# EasyEDA Pro project v1.eprj

# Schematic Schematic1
Board Name: Board1; Create Date: 2025-01-02; Page Name: P1; Project Name: v1; Schematic Name: Schematic1; Update Date: 2025-01-05; Company: myry; Drawed: myry; Page Size: A3; Reviewed: myry; Version: V1.0
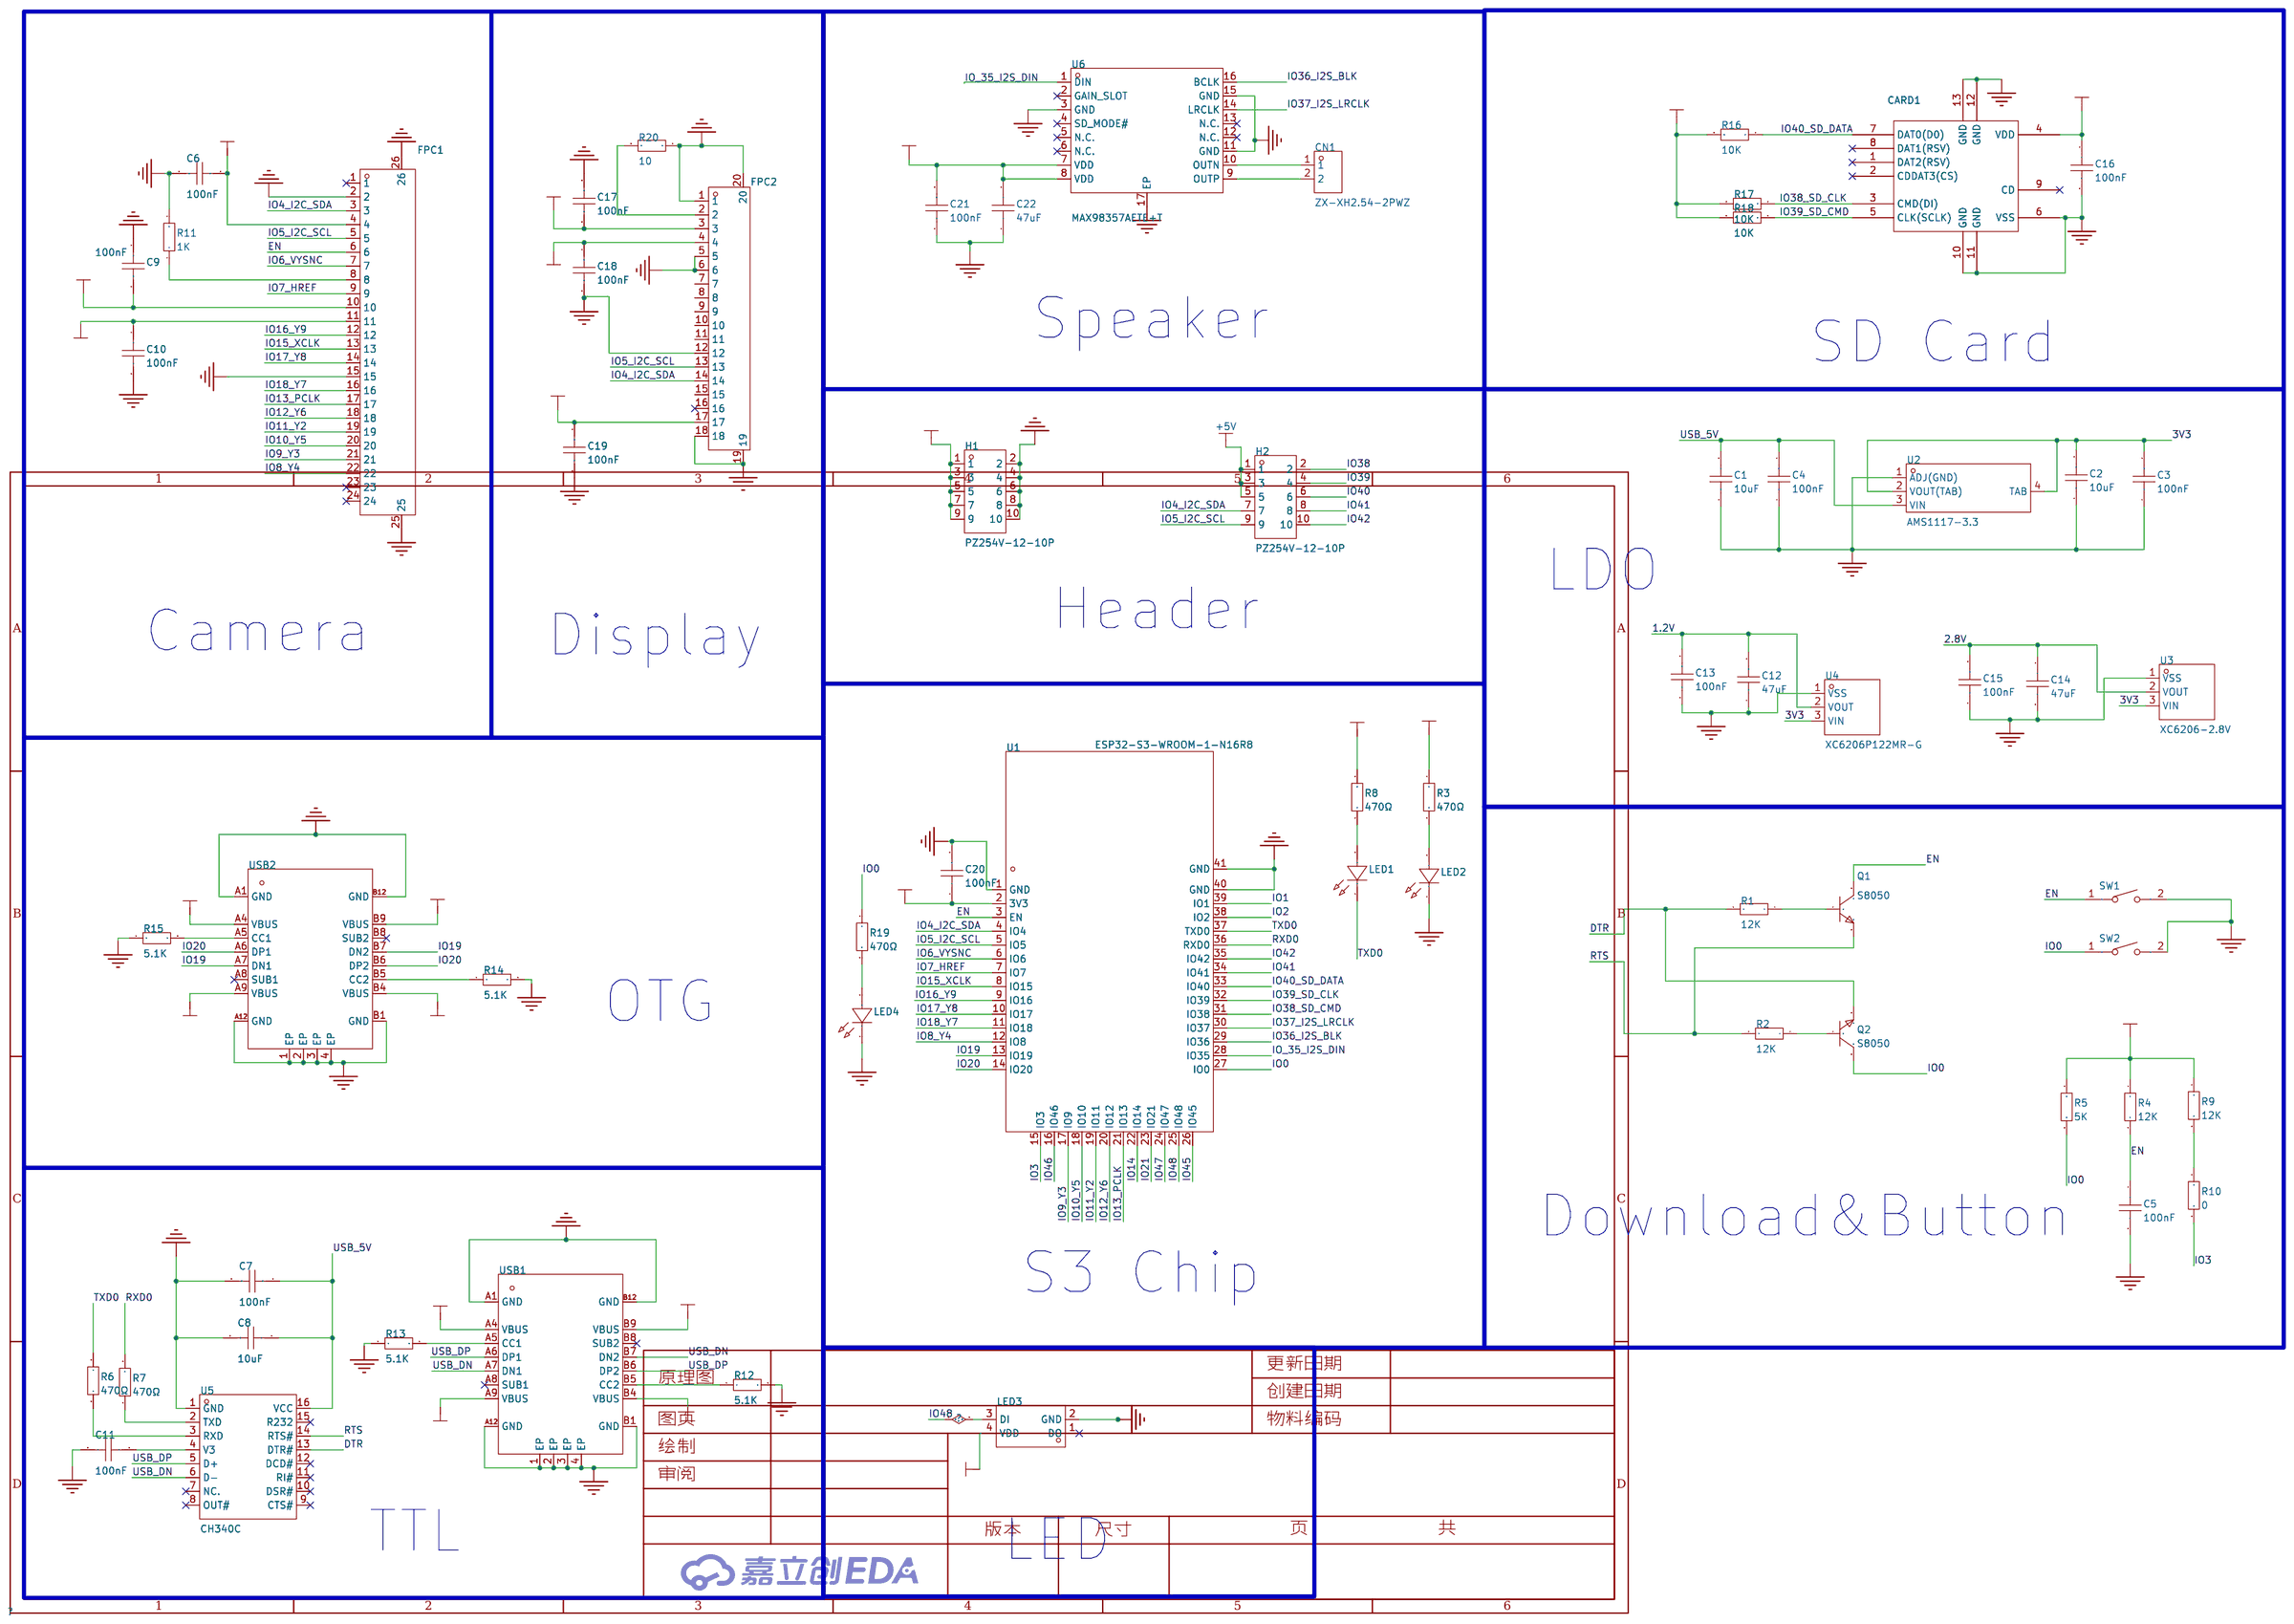
[diagram p0: schematic sheet]

## Parts
C1  10uF  [C0603]
C2  10uF  [C0603]
C3  100nF  [C0402]
C4  100nF  [C0402]
C5  100nF  [C0402]
C6  100nF  [C0402]
C7  100nF  [C0402]
C8  10uF  [C0603]
C9  100nF  [C0402]
C10  100nF  [C0402]
C11  100nF  [C0402]
C12  47uF  [C0603]
C13  100nF  [C0402]
C14  47uF  [C0603]
C15  100nF  [C0402]
C16  100nF  [C0402]
C17  100nF  [C0402]
C18  100nF  [C0402]
C19  100nF  [C0402]
C20  100nF  [C0402]
C21  100nF  [C0402]
C22  47uF  [C0603]
CARD1  TF-01A  [TF-SMD_TF-01A]
CN1  ZX-XH2.54-2PWZ  [CONN-TH_2P-P2.50_ZX-XH2.54-2PWZ]
FPC1  0.5K-DX-24PWBG  [FPC-SMD_HDGC_0.5K-DX-24PWBG]
FPC2  FPC-05F-18PH20  [FPC-SMD_18P-P0.50_FPC-05F-18PH20]
H1  PZ254V-12-10P  [HDR-TH_10P-P2.54-V-M-R2-C5-S2.54]
H2  PZ254V-12-10P  [HDR-TH_10P-P2.54-V-M-R2-C5-S2.54]
LED1  XL-1608SURC-06  [LED0603-RD_RED]
LED2  XL-1608SURC-06  [LED0603-RD_RED]
LED3  XL-2020RGBC-WS2812B  [LED-SMD_4P-L2.0-W2.0-BR-1]
LED4  XL-1608SURC-06  [LED0603-RD_RED]
Q1  S8050  [SOT-23-3_L2.9-W1.3-P1.90-LS2.3-BR]
Q2  S8050  [SOT-23-3_L2.9-W1.3-P1.90-LS2.3-BR]
R1  12K  [R0402]
R2  12K  [R0402]
R3  470Ω  [R0402]
R4  12K  [R0402]
R5  5K  [R0402]
R6  470Ω  [R0402]
R7  470Ω  [R0402]
R8  470Ω  [R0402]
R9  12K  [R0402]
R10  0  [R0402]
R11  1K  [R0402]
R12  5.1K  [R0402]
R13  5.1K  [R0402]
R14  5.1K  [R0402]
R15  5.1K  [R0402]
R16  10K  [R0402]
R17  10K  [R0402]
R18  10K  [R0402]
R19  470Ω  [R0402]
R20  10  [R0402]
SW1  TS-1088-AR02016  [SW-SMD_L3.9-W3.0-P4.45]
SW2  TS-1088-AR02016  [SW-SMD_L3.9-W3.0-P4.45]
U1  ESP32-S3-WROOM-1-N16R8  [WIRELM-SMD_ESP32-S3-WROOM-1]
U2  AMS1117-3.3  [SOT-223-4_L6.5-W3.5-P2.30-LS7.0-BR]
U3  XC6206-2.8V  [SOT-23-3_L2.9-W1.6-P1.90-LS2.8-BR]
U4  XC6206P122MR-G  [SOT-23-3_L2.9-W1.6-P1.90-LS2.8-BR]
U5  CH340C  [SOP-16_L10.0-W3.9-P1.27-LS6.0-BL]
U6  MAX98357AETE+T  [TQFN-16_L3.0-W3.0-P0.50-BL-EP1.5]
USB1  KH-TYPE-C-16P  [USB-C-SMD_KH-TYPE-C-16P]
USB2  KH-TYPE-C-16P  [USB-C-SMD_KH-TYPE-C-16P]

## Library data of the parts
C1 C2 C8 = CGA0603X5R106K100JT: LCSC Part Name: 10uF ±10% 10V; Supplier Part: C6119842; Manufacturer: HRE(芯声); Supplier Footprint: 0603; JLCPCB Part Class: 扩展库; Supplier: LCSC; Tolerance: ±10%; Voltage Rated: 10V; Temperature Coefficient: X5R
C3-C7 C9-C11 C13 C15-C21 = CL05B104KO5NNNC: LCSC Part Name: 100nF ±10% 16V; Supplier Part: C1525; Manufacturer: SAMSUNG(三星); Supplier Footprint: 0402; Datasheet: https://atta.szlcsc.com/upload/public/pdf/source/20160218/1457707763339.pdf; Supplier: LCSC; Tolerance: ±10%; Voltage Rated: 16V; Temperature Coefficient: X7R
C12 C14 C22 = CL10A476MQ8QRNC: LCSC Part Name: 47uF ±20% 6.3V; Supplier Part: C730416; Manufacturer: SAMSUNG(三星); Supplier Footprint: 0603; JLCPCB Part Class: 扩展库; Datasheet: https://atta.szlcsc.com/upload/public/pdf/source/20160218/1457707763339.pdf; Supplier: LCSC; Tolerance: ±20%; Voltage Rated: 6.3V; Temperature Coefficient: X5R
CARD1 = TF-01A_C91145: LCSC Part Name: 自弹式 MicroSD卡(TF卡) 卡座; Supplier Part: C91145; Manufacturer: 韩国韩荣; Supplier Footprint: SMD; JLCPCB Part Class: 扩展库; Datasheet: https://atta.szlcsc.com/upload/public/pdf/source/20190322/C91145_63CBD6FB4639A3A3EC6A9721F18AE0FB.pdf; Supplier: LCSC; Card Connection Mode: 自弹式; Card Type: MicroSD卡(TF卡); Connector Type: 卡座; Supplementary Features: 带定位柱; Maximum Body Height: 1.85mm
CN1 = ZX-XH2.54-2PWZ: Supplier Part: C7429641; Manufacturer: Megastar(兆星); Supplier Footprint: 弯插,P=2.54mm; JLCPCB Part Class: 扩展库; Datasheet: https://atta.szlcsc.com/upload/public/pdf/source/20230619/56AE8F2E01CDFEAA97FC89B5ED558AB5.pdf; Supplier: LCSC; Pins Structure: 1x2P; Pitch: 2.54mm; Mounting Style: 弯插; Reference Series: XH; Number of Pins: 2P; Number of Rows: 1; Number of PINs Per Row: 2; Current Rating (Max): 3A; Contact Material: 黄铜; Contact Plating: 锡; Operating Temperature Range: -25℃~+85℃
FPC1 = 0.5K-DX-24PWBG: LCSC Part Name: 间距:0.5mm P数:24P 翻盖式 下接; Supplier Part: C2911895; Manufacturer: HDGC(华德共创); Supplier Footprint: SMD,P=0.5mm,卧贴; JLCPCB Part Class: 扩展库; Datasheet: https://atta.szlcsc.com/upload/public/pdf/source/20211029/EDC59C5BA257836333CAE013AFC084A6.pdf; Supplier: LCSC; Locking Feature: 翻盖式; Contact Type: 下接; Number of Contacts: 24P; Pitch: 0.5mm; Mounting Type: 卧贴; FFC, FCB Thickness: 0.3mm; Height Above Board: 2mm; Operating Temperature Range: -20℃~+85℃
FPC2 = FPC-05F-18PH20: LCSC Part Name: 间距:0.5mm P数:18P 翻盖式 下接; Supplier Part: C2856802; Manufacturer: XUNPU(讯普); Supplier Footprint: SMD,P=0.5mm,卧贴; Datasheet: https://atta.szlcsc.com/upload/public/pdf/source/20210922/C2856802_2A845D1961F33AEC1ED22CECB292335F.pdf; Supplier: LCSC; Locking Feature: 翻盖式; Contact Type: 下接; Number of Contacts: 18P; Pitch: 0.5mm; Mounting Type: 卧贴; FFC, FCB Thickness: 0.3mm; Height Above Board: 2mm; Operating Temperature Range: -25℃~+85℃
H1 H2 = PZ254V-12-10P: LCSC Part Name: 间距:2.54mm 2x5P 直插 方针; Supplier Part: C492422; Manufacturer: XFCN(兴飞); Supplier Footprint: 插件,P=2.54mm; Datasheet: https://atta.szlcsc.com/upload/public/pdf/source/20200309/C492422_5020CEA01BE7051F9EA9DD81AB0A25E3.pdf; Supplier: LCSC; Pin Structure: 2x5P; Pitch: 2.54mm; Row Spacing: 2.54mm; Circluar Pins/Square Pins: 方针; Mounting Type: 直插; Number of Rows: 双排; Number of Pins: 10P; Length of Mating Pin: 6mm; Insulation Height: 2.5mm; Length of End Connection Pin: 3mm; Contact Material: 黄铜; Operating Temperature Range: -40℃~+105℃; Color: 黑色
LED1 LED2 LED4 = XL-1608SURC-06: Supplier Part: C965799; Manufacturer: XINGLIGHT(成兴光); Supplier Footprint: 0603; JLCPCB Part Class: 扩展库; Datasheet: https://atta.szlcsc.com/upload/public/pdf/source/20221102/D860AFDD1CDB02C5A8064103A32707E2.pdf; Supplier: LCSC; Emitted Color: 红色; Power Dissipation: 55mW; Forward Current: 25mA; Dominant Wavelength: 617nm~621nm; Peak Wavelength: 623nm; Lens Color: 无色透明透镜; Viewing Angle: 120°; Mounting Sytle: 正贴; Operating Temperature: -30℃~+85℃
LED3 = XL-2020RGBC-WS2812B: LCSC Part Name: 幻彩透明; Supplier Part: C5349955; Manufacturer: XINGLIGHT(成兴光); Supplier Footprint: 2020; JLCPCB Part Class: 扩展库; Datasheet: https://atta.szlcsc.com/upload/public/pdf/source/20230111/97A2D5930F183799801175706AF118AF.pdf; Supplier: LCSC; Wavelength: 620nm~625nm；470nm~475nm；525nm~530nm; Luminous Intensity: 150mcd；150mcd；400mcd; Lens Color: 半透明雾状透镜; Installation method: 正贴; Operating Temperature: -20℃~+85℃
Q1 Q2 = S8050_C20069125: LCSC Part Name: hFE:200-350，丝印:J3Y; Supplier Part: C20069125; Manufacturer: 宏迦橙; Supplier Footprint: SOT-23; JLCPCB Part Class: 扩展库; Datasheet: https://atta.szlcsc.com/upload/public/pdf/source/20240403/2D78449C96B6E27F13BF8BDF79E27159.pdf; Supplier: LCSC; Transistor Type: NPN; Collector Current (Ic): 500mA; Collector-Emitter Breakdown Voltage (Vceo): 25V; Power Dissipation (Pd): 300mW; DC Current Gain (hFE@Ic,Vce): 120@50mA,1.0V; Transition Frequency (fT): 100MHz; Collector Cut-Off Current (Icbo): 100nA; Collector-Emitter Saturation Voltage (VCE(sat)@Ic,Ib): 600mV@500mA,50mA; Operating Temperature: -55℃~+150℃
R1-R20 = 0402WGF4700TCE: LCSC Part Name: 470Ω ±1% 62.5mW 厚膜电阻; Supplier Part: C25117; Manufacturer: UNI-ROYAL(厚声); Supplier Footprint: 0402; JLCPCB Part Class: 基础库; Datasheet: https://atta.szlcsc.com/upload/public/pdf/source/20200306/C422600_1E6D84923E4A46A82E41ADD87F860B5C.pdf; Supplier: LCSC; Type: 厚膜电阻; Tolerance: ±1%; Power(Watts): 62.5mW; Overload Voltage (Max): 50V; Temperature Coefficient: ±100ppm/℃; Operating Temperature Range: -55℃~+155℃
SW1 SW2 = TS-1088-AR02016: LCSC Part Name: 4*3*2mm 立贴 轻触开关; Supplier Part: C720477; Manufacturer: XUNPU(讯普); Supplier Footprint: SMD; JLCPCB Part Class: 扩展库; Datasheet: https://atta.szlcsc.com/upload/public/pdf/source/20200810/C720475_60D09DD6C54279ADDB2DC25100F1CC11.pdf; Supplier: LCSC; Circuit: 单刀单掷; Actuator Style: 圆形按钮; Operating Force: 160gf; Mounting Style: 立贴; Switch Length: 4mm; Switch Width: 3mm; Switch Height: 2mm; Strike Gundam: 不带; Contact Current: 50mA; Voltage Rating (DC): 12V; Insulation Resistance: 100MΩ; Actuator/Cap Color: 黑色; Pin Style: SMD接片; Mechanical Life: 10万次; Operating Temperature: -30℃~+80℃
U1 = ESP32-S3-WROOM-1-N16R8: LCSC Part Name: 通用型Wi-Fi+低功耗蓝牙MCU模组; Supplier Part: C2913202; Manufacturer: ESPRESSIF(乐鑫); Supplier Footprint: SMD,18x25.5mm; JLCPCB Part Class: 扩展库; Datasheet: https://atta.szlcsc.com/upload/public/pdf/source/20220705/4E799F39581577F766659887F738A439.pdf; Supplier: LCSC
U2 = AMS1117-3.3_C347222: LCSC Part Name: 输出:3.3V 电流:1A 耐压:12V; Supplier Part: C347222; Manufacturer: UMW(友台半导体); Supplier Footprint: SOT-223; JLCPCB Part Class: 扩展库; Datasheet: https://atta.szlcsc.com/upload/public/pdf/source/20241218/BAF0263FA2E44BCD8AF41AA4FA04EFAA.pdf; Supplier: LCSC; Output Type: 固定; Maximum Input Voltage: 12V; Output Voltage: 3.3V; Output Current: 1A; Power Supply Rejection Ratio (PSRR): 60dB@(120Hz); Dropout Voltage: 1.3V@(1A); Feature: 过流保护(OCP); Output Polarity: 正极; Number of Outputs: 1
U3 = XC6206-2.8V: LCSC Part Name: 输入6V 输出2.8V 250mA; Supplier Part: C2892669; Manufacturer: YONGYUTAI(永裕泰); Supplier Footprint: SOT-23-3L; JLCPCB Part Class: 扩展库; Datasheet: https://atta.szlcsc.com/upload/public/pdf/source/20210901/DE3C77F0CE73FFE8F7C655BE9B94CB06.pdf; Supplier: LCSC; Output Type: 固定; Maximum Input Voltage: 6V; Output Voltage: 2.8V; MAX Output Current: 250mA; Operating Temperature: -40℃~+85℃@(Tj); Output Polarity: 正极; Number of Outputs: 1
U4 = XC6206P122MR-G: LCSC Part Name: 输入7V 输出1.2V~1.2V 60mA; Supplier Part: C424699; Manufacturer: TOREX(特瑞仕); Supplier Footprint: SOT-23; JLCPCB Part Class: 扩展库; Datasheet: https://atta.szlcsc.com/upload/public/pdf/source/20200117/C484266_EE638359EA530088949E891FD0EEEA32.pdf; Supplier: LCSC; Output Type: 固定; Maximum Input Voltage: 7V; Output Voltage: 1.2V; MAX Output Current: 60mA; Dropout Voltage: 960mV@(60mA); standby current: 3uA; Operating Temperature: -40℃~+85℃@(Ta); Output Polarity: 正极; Number of Outputs: 1
U5 = CH340C: LCSC Part Name: CH340C USB转串口芯片 CH340; Supplier Part: C84681; Manufacturer: WCH(南京沁恒); Supplier Footprint: SOP-16; Datasheet: https://atta.szlcsc.com/upload/public/pdf/source/20240619/63986D8440D4E5267A77ACD891CC4DE3.pdf; Supplier: LCSC; Applications Function: 收发器; Protocol: USB 2.0; Supply Voltage: 3.3V；5V; Data Rate: 2Mbps
U6 = MAX98357AETE+T: LCSC Part Name: 微型、低成本、PCM 类 D 级放大器具有 AB 级性能; Supplier Part: C910544; Manufacturer: ADI(亚德诺)/MAXIM(美信); Supplier Footprint: TQFN-16-EP(3x3); JLCPCB Part Class: 扩展库; Datasheet: https://atta.szlcsc.com/upload/public/pdf/source/20210106/C910544_CB6DE4B2CEE254A72E6BDB40E718D281.pdf; Supplier: LCSC; Speaker Channels: 单声道; Output Power: 3.2Wx2@4Ω; Supply Voltage: 2.5V~5.5V; Operating Temperature: -40℃~+85℃
USB1 USB2 = KH-TYPE-C-16P: LCSC Part Name: Type-C 母 卧贴; Supplier Part: C709357; Manufacturer: kinghelm(金航标); Supplier Footprint: SMD; Datasheet: https://atta.szlcsc.com/upload/public/pdf/source/20200911/C709357_AA8DCEB38BB20E3035A7ED7AE7667837.pdf; Supplier: LCSC; Connector Type: Type-C; Gender: 母; Number of Ports: 1; Number of Contacts: 16P; Mounting Style: 卧贴; Current Rating - Power (Max): 3A; Operating Temperature Range: -40℃~+85℃

## Nets
1.2V: C9.2 C12.2 C13.2 FPC1.10 U4.2(VOUT)
1.8V: C18.1 FPC2.4
2.8V: C6.1 C10.1 C14.1 C15.2 FPC1.4 FPC1.11 U3.2(VOUT)
3V3: C2.2 C3.2 C16.1 C17.2 C19.1 C20.1 C21.2 C22.2 CARD1.4(VDD) FPC2.3 FPC2.17 H1.1 H1.3 H1.5 H1.7 H1.9 R3.1 R4.1 R5.1 R8.2 R9.1 R16.2 R17.2 R18.2 U1.2(3V3) U2.2(VOUT(TAB)) U2.4(TAB) U3.3(VIN) U4.3(VIN) U6.7(VDD) U6.8(VDD)
+5V: H2.1 H2.3 H2.5
GND: C1.1 C2.1 C3.1 C4.1 C5.2 C6.2 C7.2 C8.2 C9.1 C10.2 C11.2 C12.1 C13.1 C14.2 C15.1 C16.2 C17.1 C18.2 C19.2 C20.2 C21.1 C22.1 CARD1.6(VSS) CARD1.10(GND) CARD1.11(GND) CARD1.12(GND) CARD1.13(GND) FPC1.2 FPC1.15 FPC1.25 FPC1.26 FPC2.1 FPC2.5 FPC2.6 FPC2.12 FPC2.18 FPC2.19 FPC2.20 H1.2 H1.4 H1.6 H1.8 H1.10 LED2.1(K) LED3.2(GND) LED4.1(K) R11.2 R12.2 R13.1 R14.2 R15.1 R20.1 SW1.2 SW2.2 U1.1(GND) U1.40(GND) U1.41(GND) U2.1(ADJ(GND)) U3.1(VSS) U4.1(VSS) U5.1(GND) U6.3(GND) U6.11(GND) U6.15(GND) U6.17(EP) USB1.1(EP) USB1.2(EP) USB1.3(EP) USB1.4(EP) USB1.A1(GND) USB1.A12(GND) USB1.B1(GND) USB1.B12(GND) USB2.1(EP) USB2.2(EP) USB2.3(EP) USB2.4(EP) USB2.A1(GND) USB2.A12(GND) USB2.B1(GND) USB2.B12(GND)
DTR: Q2.2(E) R1.2 U5.13(DTR#)
EN: C5.1 FPC1.6 Q1.3(C) R4.2 SW1.1 U1.3(EN)
IO0: Q2.3(C) R5.2 R19.1 SW2.1 U1.27(IO0)
IO1: U1.39(IO1)
IO2: U1.38(IO2)
IO3: R10.2 U1.15(IO3)
IO4_I2C_SDA: FPC1.3 FPC2.14 H2.7 U1.4(IO4)
IO5_I2C_SCL: FPC1.5 FPC2.13 H2.9 U1.5(IO5)
IO6_VYSNC: FPC1.7 U1.6(IO6)
IO7_HREF: FPC1.9 U1.7(IO7)
IO8_Y4: FPC1.22 U1.12(IO8)
IO9_Y3: FPC1.21 U1.17(IO9)
IO10_Y5: FPC1.20 U1.18(IO10)
IO11_Y2: FPC1.19 U1.19(IO11)
IO12_Y6: FPC1.18 U1.20(IO12)
IO13_PCLK: FPC1.17 U1.21(IO13)
IO14: U1.22(IO14)
IO15_XCLK: FPC1.13 U1.8(IO15)
IO16_Y9: FPC1.12 U1.9(IO16)
IO17_Y8: FPC1.14 U1.10(IO17)
IO18_Y7: FPC1.16 U1.11(IO18)
IO19: U1.13(IO19) USB2.A7(DN1) USB2.B7(DN2)
IO20: U1.14(IO20) USB2.A6(DP1) USB2.B6(DP2)
IO21: U1.23(IO21)
IO36_I2S_BLK: U1.29(IO36) U6.16(BCLK)
IO37_I2S_LRCLK: U1.30(IO37) U6.14(LRCLK)
IO38: H2.2
IO38_SD_CLK: CARD1.3(CMD(DI)) R17.1
IO38_SD_CMD: U1.31(IO38)
IO39: H2.4
IO39_SD_CLK: U1.32(IO39)
IO39_SD_CMD: CARD1.5(CLK(SCLK)) R18.1
IO40: H2.6
IO40_SD_DATA: CARD1.7(DAT0(D0)) R16.1 U1.33(IO40)
IO41: H2.8 U1.34(IO41)
IO42: H2.10 U1.35(IO42)
IO45: U1.26(IO45)
IO46: U1.16(IO46)
IO47: U1.24(IO47)
IO48: LED3.3(DI) U1.25(IO48)
IO_35_I2S_DIN: U1.28(IO35) U6.1(DIN)
RTS: Q1.2(E) R2.2 U5.14(RTS#)
RXD0: R7.2 U1.36(RXD0)
TXD0: LED1.1(K) R6.2 U1.37(TXD0)
USB_5V: C1.2 C4.2 C7.1 C8.1 LED3.4(VDD) U2.3(VIN) U5.16(VCC) USB1.A4(VBUS) USB1.A9(VBUS) USB1.B4(VBUS) USB1.B9(VBUS) USB2.A4(VBUS) USB2.A9(VBUS) USB2.B4(VBUS) USB2.B9(VBUS)
USB_DN: U5.6(D-) USB1.A7(DN1) USB1.B7(DN2)
USB_DP: U5.5(D+) USB1.A6(DP1) USB1.B6(DP2)
$1N2354: R7.1 U5.2(TXD)
$1N2360: R6.1 U5.3(RXD)
$1N2405: C11.1 U5.4(V3)
$1N2645: Q1.1(B) R1.1
$1N2696: Q2.1(B) R2.1
$1N2996: R9.2 R10.1
$1N4989: FPC1.8 R11.1
$1N10095: FPC2.2 R20.2
$1N11048: CN1.1 U6.10(OUTN)
$1N11058: CN1.2 U6.9(OUTP)
Net-(LED1-2): LED1.2(A) R8.1
Net-(LED2-2): LED2.2(A) R3.2
Net-(LED4-2): LED4.2(A) R19.2
Net-(R12-1): R12.1 USB1.B5(CC2)
Net-(R13-2): R13.2 USB1.A5(CC1)
Net-(R14-1): R14.1 USB2.B5(CC2)
Net-(R15-2): R15.2 USB2.A5(CC1)

Not connected (* = marked no-connect by the designer): CARD1 1(DAT2(RSV))* 2(CDDAT3(CS))* 8(DAT1(RSV))* 9(CD)*; FPC1 1* 23* 24*; FPC2 7 8 9 10 11 15 16*; LED3 1(DO)*; U5 7(NC.)* 8(OUT#)* 9(CTS#)* 10(DSR#)* 11(RI#)* 12(DCD#)* 15(R232)*; U6 2(GAIN_SLOT)* 4(SD_MODE#)* 5(N.C.)* 6(N.C.)* 12(N.C.)* 13(N.C.)*; USB1 A8(SUB1)* B8(SUB2)*; USB2 A8(SUB1)* B8(SUB2)*

## Notes on the sheet
- Speaker
- SD Card
- LDO
- Header
- Camera
- Display
- OTG
- Download&Button
- S3 Chip
- TTL
- LED

# Board PCB1
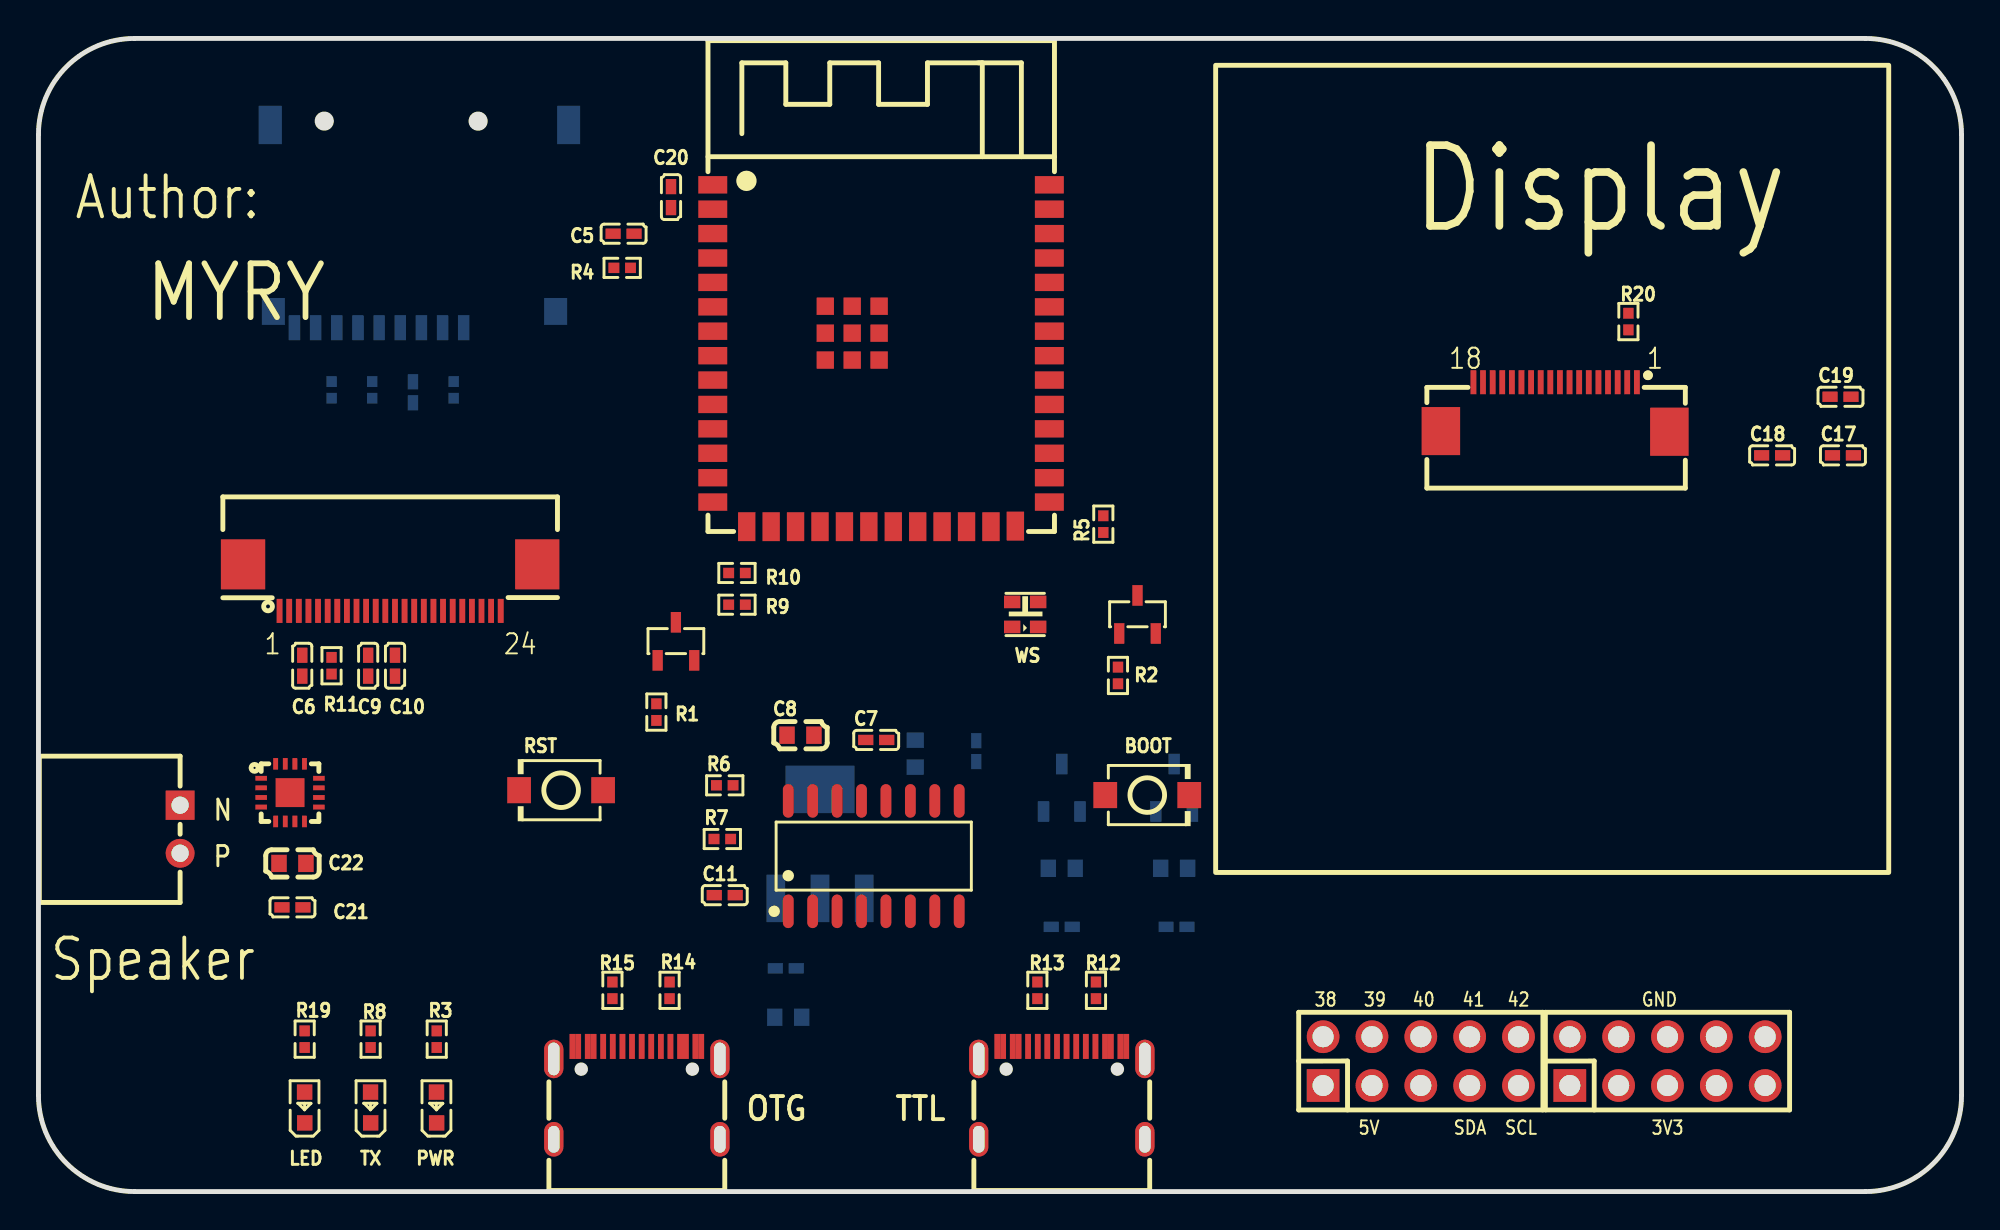
[diagram p1: board, top side]
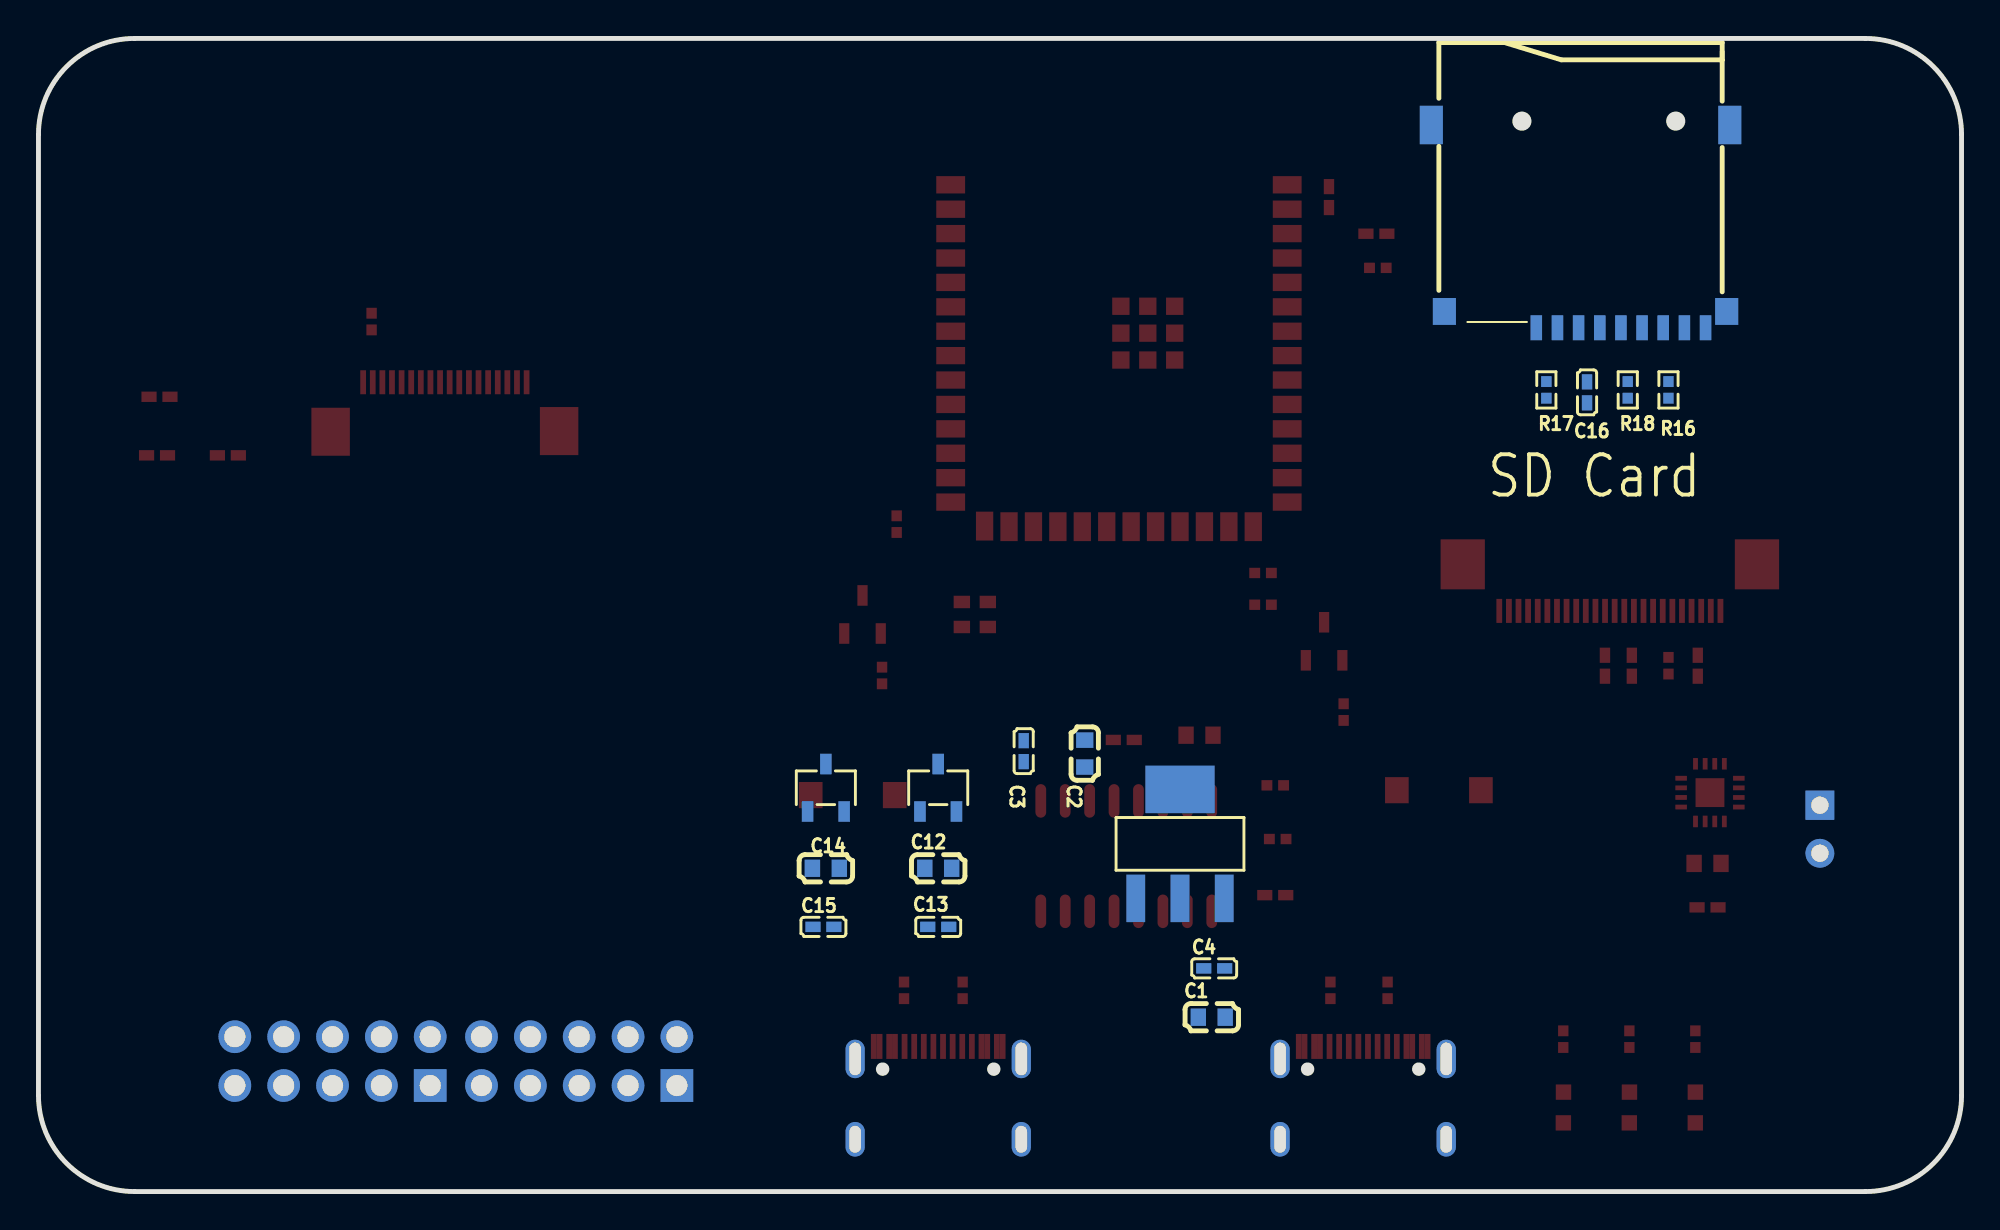
[diagram p2: board, bottom side, seen from below]

Outline 100 x 60 mm; copper layers: Top Layer, Bottom Layer. Coordinates in mm from the lower left corner of the outline.
Outline path: 0,55 0,5 arc(1.46,1.46) 5,0 95,0 arc(98.54,1.46) 100,5 100,55 arc(98.54,58.54) 95,60 5,60 arc(1.46,58.54) 0,55
Stack: Top Layer 0.035mm / Dielectric1 1.51mm FR4 er 4.5 / Bottom Layer 0.035mm

## Design rules (mm)
template: JLCPCB Capability(Two Layers Board)
spacing copperThickness1oz (default): track to track 0.102, other pairs 0.152 to 0.3
spacing copperThickness2oz: track to track 0.203, other pairs 0.152 to 0.3
track width copperThickness1oz (default): min 0.127, default 0.254, max 2.54
track width copperThickness2oz: min 0.203, default 0.254, max 2.54
differential pair differentialPair (default): width min 0.127, default 0.254, max 2.54; gap min 0.152, default 0.152
via viaSize (default): diameter min 0.5, default 0.61, max 10; hole min 0.3, default 0.305, max 6.3

## Placement (name value [footprint] x y rotation side)
BOOT  TS-1088-AR02016  [SW-SMD_L3.9-W3.0-P4.45]  57.66 20.63 0 top
C1  10uF  [C0603]  38.99 9.07 180 bottom
C2  10uF  [C0603]  45.59 22.79 90 bottom
C3  100nF  [C0402]  48.77 22.92 90 bottom
C4  100nF  [C0402]  38.86 11.61 180 bottom
C5  100nF  [C0402]  30.43 49.84 180 top
C6  100nF  [C0402]  13.72 27.36 270 top
C7  100nF  [C0402]  43.56 23.5 0 top
C8  10uF  [C0603]  39.62 23.75 0 top
C9  100nF  [C0402]  17.14 27.36 90 top
C10  100nF  [C0402]  18.54 27.36 270 top
C11  100nF  [C0402]  35.69 15.42 0 top
C12  47uF  [C0603]  53.21 16.82 180 bottom
C13  100nF  [C0402]  53.21 13.77 180 bottom
C14  47uF  [C0603]  59.06 16.82 0 bottom
C15  100nF  [C0402]  59.18 13.77 180 bottom
C16  100nF  [C0402]  19.47 41.58 270 bottom
C17  100nF  [C0402]  93.83 38.31 0 top
C18  100nF  [C0402]  90.15 38.31 0 top
C19  100nF  [C0402]  93.71 41.36 0 top
C20  100nF  [C0402]  32.89 51.75 90 top
C21  100nF  [C0402]  13.21 14.79 0 top
C22  47uF  [C0603]  13.21 17.07 0 top
CARD1  TF-01A  [TF-SMD_TF-01A]  19.81 50.22 0 bottom
CN1  ZX-XH2.54-2PWZ  [CONN-TH_2P-P2.50_ZX-XH2.54-2PWZ]  7.37 18.85 270 top
FPC1  0.5K-DX-24PWBG  [FPC-SMD_HDGC_0.5K-DX-24PWBG]  18.29 31.42 180 top
FPC2  FPC-05F-18PH20  [FPC-SMD_18P-P0.50_FPC-05F-18PH20]  78.87 40.82 0 top
H1  PZ254V-12-10P  [HDR-TH_10P-P2.54-V-M-R2-C5-S2.54]  84.71 6.79 0 top
H2  PZ254V-12-10P  [HDR-TH_10P-P2.54-V-M-R2-C5-S2.54]  71.88 6.79 0 top
LED  XL-1608SURC-06  [LED0603-RD_RED]  13.84 4.37 90 top
OTG  KH-TYPE-C-16P  [USB-C-SMD_KH-TYPE-C-16P]  31.12 5.14 0 top
PWR  XL-1608SURC-06  [LED0603-RD_RED]  20.7 4.37 90 top
Q1  S8050  [SOT-23-3_L2.9-W1.3-P1.90-LS2.3-BR]  33.15 28.63 270 top
Q2  S8050  [SOT-23-3_L2.9-W1.3-P1.90-LS2.3-BR]  57.15 30.03 270 top
R1  12K  [R0402]  32.13 24.95 270 top
R2  12K  [R0402]  56.13 26.85 270 top
R3  470Ω  [R0402]  20.71 7.93 270 top
R4  12K  [R0402]  30.35 48.06 0 top
R5  5K  [R0402]  55.37 34.73 90 top
R6  470Ω  [R0402]  35.69 21.14 0 top
R7  470Ω  [R0402]  35.56 18.34 0 top
R8  470Ω  [R0402]  17.27 7.93 90 top
R9  12K  [R0402]  36.32 30.54 180 top
R10  0  [R0402]  36.32 32.19 0 top
R11  1K  [R0402]  15.24 27.36 270 top
R12  5.1K  [R0402]  54.99 10.47 90 top
R13  5.1K  [R0402]  51.94 10.47 270 top
R14  5.1K  [R0402]  32.82 10.47 90 top
R15  5.1K  [R0402]  29.84 10.47 270 top
R16  10K  [R0402]  15.24 41.71 270 bottom
R17  10K  [R0402]  21.59 41.71 270 bottom
R18  10K  [R0402]  17.36 41.71 270 bottom
R19  470Ω  [R0402]  13.84 7.93 270 top
R20  10  [R0402]  82.68 45.27 270 top
RST  TS-1088-AR02016  [SW-SMD_L3.9-W3.0-P4.45]  27.18 20.88 180 top
TTL  KH-TYPE-C-16P  [USB-C-SMD_KH-TYPE-C-16P]  53.21 5.14 0 top
TX  XL-1608SURC-06  [LED0603-RD_RED]  17.27 4.37 90 top
U1  ESP32-S3-WROOM-1-N16R8  [WIRELM-SMD_ESP32-S3-WROOM-1]  43.81 43.49 0 top
U2  AMS1117-3.3  [SOT-223-4_L6.5-W3.5-P2.30-LS7.0-BR]  40.64 18.09 270 bottom
U3  XC6206-2.8V  [SOT-23-3_L2.9-W1.6-P1.90-LS2.8-BR]  59.06 21.01 270 bottom
U4  XC6206P122MR-G  [SOT-23-3_L2.9-W1.6-P1.90-LS2.8-BR]  53.21 21.01 270 bottom
U5  CH340C  [SOP-16_L10.0-W3.9-P1.27-LS6.0-BL]  43.43 17.45 0 top
U6  MAX98357AETE+T  [TQFN-16_L3.0-W3.0-P0.50-BL-EP1.5]  13.08 20.76 270 top
WS  XL-2020RGBC-WS2812B  [LED-SMD_4P-L2.0-W2.0-BR-1]  51.31 30.03 0 top

## Footprints (pads in the part's own frame, mm; a bottom-side part is the same pattern mirrored in y, then rotated)
C0402
  rect 0.79x0.54 smd: 1(-0.545,0) 2(0.545,0)
C0603
  rect 0.8x0.9 smd: 1(-0.7,0) 2(0.7,0)
CONN-TH_2P-P2.50_ZX-XH2.54-2PWZ
  rect 1.524x1.5 hole 0.9: 1(-1.25,0)
  round 1.5 hole 0.9: 2(1.25,0)
FPC-SMD_18P-P0.50_FPC-05F-18PH20
  rect 0.3x1.25 smd: 1(4.25,1.288) 2(3.75,1.288) 3(3.25,1.288) 4(2.75,1.288) 5(2.25,1.288) 6(1.75,1.288) 7(1.25,1.288) 8(0.75,1.288) 9(0.25,1.288) 10(-0.25,1.288) 11(-0.75,1.288) 12(-1.25,1.288) 13(-1.75,1.288) 14(-2.25,1.288) 15(-2.75,1.288) 16(-3.25,1.288) 17(-3.75,1.288) 18(-4.25,1.288)
  rect 2x2.5 smd: 19(5.94,-1.288) 20(-5.94,-1.252)
FPC-SMD_HDGC_0.5K-DX-24PWBG
  rect 0.3x1.25 smd: 1(5.75,1.212) 2(5.25,1.212) 3(4.75,1.212) 4(4.25,1.212) 5(3.75,1.212) 6(3.25,1.212) 7(2.75,1.212) 8(2.25,1.212) 9(1.75,1.212) 10(1.25,1.212) 11(0.75,1.212) 12(0.25,1.212) 13(-0.25,1.212) 14(-0.75,1.212) 15(-1.25,1.212) 16(-1.75,1.212) 17(-2.25,1.212) 18(-2.75,1.212) 19(-3.25,1.212) 20(-3.75,1.212) 21(-4.25,1.212) 22(-4.75,1.212) 23(-5.25,1.212) 24(-5.75,1.212)
  rect 2.3x2.6 smd: 25(-7.65,-1.212) 26(7.65,-1.212)
HDR-TH_10P-P2.54-V-M-R2-C5-S2.54
  rect 1.7x1.7 hole 1.1: 1(-5.08,-1.27)
  round 1.7 hole 1.1: 2(-5.08,1.27) 3(-2.54,-1.27) 4(-2.54,1.27) 5(0,-1.27) 6(0,1.27) 7(2.54,-1.27) 8(2.54,1.27) 9(5.08,-1.27) 10(5.08,1.27)
LED0603-RD_RED
  rect 0.8x0.8 smd: 1(-0.799,-0.004) 2(0.799,0.004)
LED-SMD_4P-L2.0-W2.0-BR-1
  rect 0.85x0.65 smd: 1(0.675,-0.65) 2(0.675,0.65) 3(-0.675,0.65) 4(-0.675,-0.65)
R0402
  rect 0.566x0.54 smd: 1(-0.433,0) 2(0.433,0)
SOP-16_L10.0-W3.9-P1.27-LS6.0-BL
  oval 0.56x1.745 smd: 1(-4.445,-2.873) 2(-3.175,-2.873) 3(-1.905,-2.873) 4(-0.635,-2.873) 5(0.635,-2.873) 6(1.905,-2.873) 7(3.175,-2.873) 8(4.445,-2.873) 9(4.445,2.873) 10(3.175,2.873) 11(1.905,2.873) 12(0.635,2.873) 13(-0.635,2.873) 14(-1.905,2.873) 15(-3.175,2.873) 16(-4.445,2.873)
SOT-23-3_L2.9-W1.3-P1.90-LS2.3-BR
  rect 1.07x0.532 smd: 1(0.99,-0.95) 2(0.99,0.95) 3(-0.99,0)
SOT-23-3_L2.9-W1.6-P1.90-LS2.8-BR
  rect 1.07x0.6 smd: 1(1.235,-0.95) 2(1.235,0.95) 3(-1.235,0)
SOT-223-4_L6.5-W3.5-P2.30-LS7.0-BR
  rect 2.47x0.98 smd: 1(2.835,-2.3) 2(2.835,0) 3(2.835,2.3)
  rect 2.47x3.6 smd: 4(-2.835,0)
SW-SMD_L3.9-W3.0-P4.45
  rect 1.23x1.36 smd: 1(-2.185,0) 2(2.185,0)
TF-SMD_TF-01A
  rect 0.6x1.3 smd: 1(2.3,5.276) 2(1.2,5.276) 3(0.101,5.276) 4(-1,5.276) 5(-2.099,5.276) 6(-3.2,5.276) 7(-4.3,5.276) 8(-5.399,5.276) 9(-6.5,5.276)
  rect 1.2x1.4 smd: 10(-7.599,4.426) 13(7.08,4.426)
  rect 1.2x2 smd: 11(-7.76,-5.276) 12(7.76,-5.276)
TQFN-16_L3.0-W3.0-P0.50-BL-EP1.5
  rect 0.25x0.6 smd: 1(-0.749,-1.5) 2(-0.248,-1.5) 3(0.252,-1.5) 4(0.751,-1.5) 9(0.75,1.5) 10(0.25,1.5) 11(-0.25,1.5) 12(-0.749,1.5)
  rect 0.6x0.25 smd: 5(1.5,-0.748) 6(1.5,-0.248) 7(1.5,0.252) 8(1.5,0.752) 13(-1.5,0.752) 14(-1.5,0.252) 15(-1.5,-0.248) 16(-1.5,-0.748)
  rect 1.5x1.5 smd: 17(0,0)
USB-C-SMD_KH-TYPE-C-16P
  oval 1x2 hole 0.6x1.7: 1(-4.32,1.765) 2(4.32,1.765)
  oval 1x1.8 hole 0.6x1.4: 3(-4.32,-2.415) 4(4.32,-2.415)
  rect 0.3x1.3 smd: A1(-3.35,2.415) A4(-2.55,2.415) A5(-1.25,2.415) A6(-0.25,2.415) A7(0.25,2.415) A8(1.25,2.415) A9(2.55,2.415) A12(3.35,2.415) B1(3.05,2.415) B4(2.25,2.415) B5(1.75,2.415) B6(0.75,2.415) B7(-0.75,2.415) B8(-1.75,2.415) B9(-2.25,2.415) B12(-3.05,2.415)
WIRELM-SMD_ESP32-S3-WROOM-1
  rect 1.5x0.9 smd: 1(-8.75,8.895) 2(-8.75,7.625) 3(-8.75,6.355) 4(-8.75,5.085) 5(-8.75,3.815) 6(-8.75,2.545) 7(-8.75,1.275) 8(-8.75,0.005) 9(-8.75,-1.265) 10(-8.75,-2.535) 11(-8.75,-3.805) 12(-8.75,-5.075) 13(-8.75,-6.345) 14(-8.75,-7.615) 27(8.75,-7.615) 28(8.75,-6.345) 29(8.75,-5.075) 30(8.75,-3.805) 31(8.75,-2.535) 32(8.75,-1.265) 33(8.75,0.005) 34(8.75,1.275) 35(8.75,2.545) 36(8.75,3.815) 37(8.75,5.085) 38(8.75,6.355) 39(8.75,7.625) 40(8.75,8.895)
  rect 0.9x1.5 smd: 15(-6.985,-8.895) 16(-5.715,-8.895) 17(-4.445,-8.895) 18(-3.175,-8.895) 19(-1.905,-8.895) 20(-0.635,-8.895) 21(0.635,-8.895) 22(1.905,-8.895) 23(3.175,-8.895) 24(4.445,-8.895) 25(5.715,-8.895) 26(6.985,-8.865)
  rect 0.9x0.9 smd: 41(-2.9,2.575) 41(-2.9,1.175) 41(-2.9,-0.225) 41(-1.5,2.575) 41(-1.5,1.175) 41(-1.5,-0.225) 41(-0.1,2.575) 41(-0.1,1.175) 41(-0.1,-0.225)

## Nets
1.2V: C9.2 C12.2 C13.2 FPC1.10 U4.2
1.8V: C18.1 FPC2.4
2.8V: C6.1 C10.1 C14.1 C15.2 FPC1.4 FPC1.11 U3.2
3V3: C2.2 C3.2 C16.1 C17.2 C19.1 C20.1 C21.2 C22.2 CARD1.4 FPC2.3 FPC2.17 H1.1 H1.3 H1.5 H1.7 H1.9 R3.1 R4.1 R5.1 R8.2 R9.1 R16.2 R17.2 R18.2 U1.2 U2.2 U2.4 U3.3 U4.3 U6.7 U6.8
+5V: H2.1 H2.3 H2.5
GND: BOOT.2 C1.1 C2.1 C3.1 C4.1 C5.2 C6.2 C7.2 C8.2 C9.1 C10.2 C11.2 C12.1 C13.1 C14.2 C15.1 C16.2 C17.1 C18.2 C19.2 C20.2 C21.1 C22.1 CARD1.6 CARD1.10 CARD1.11 CARD1.12 CARD1.13 FPC1.2 FPC1.15 FPC1.25 FPC1.26 FPC2.1 FPC2.5 FPC2.6 FPC2.12 FPC2.18 FPC2.19 FPC2.20 H1.2 H1.4 H1.6 H1.8 H1.10 LED.1 OTG.1 OTG.2 OTG.3 OTG.4 OTG.A1 OTG.A12 OTG.B1 OTG.B12 PWR.1 R11.2 R12.2 R13.1 R14.2 R15.1 R20.1 RST.2 TTL.1 TTL.2 TTL.3 TTL.4 TTL.A1 TTL.A12 TTL.B1 TTL.B12 U1.1 U1.40 U1.41 U2.1 U3.1 U4.1 U5.1 U6.3 U6.11 U6.15 U6.17 WS.2
DTR: Q2.2 R1.2 U5.13
EN: C5.1 FPC1.6 Q1.3 R4.2 RST.1 U1.3
IO0: BOOT.1 Q2.3 R5.2 R19.1 U1.27
IO1: U1.39
IO2: U1.38
IO3: R10.2 U1.15
IO4_I2C_SDA: FPC1.3 FPC2.14 H2.7 U1.4
IO5_I2C_SCL: FPC1.5 FPC2.13 H2.9 U1.5
IO6_VYSNC: FPC1.7 U1.6
IO7_HREF: FPC1.9 U1.7
IO8_Y4: FPC1.22 U1.12
IO9_Y3: FPC1.21 U1.17
IO10_Y5: FPC1.20 U1.18
IO11_Y2: FPC1.19 U1.19
IO12_Y6: FPC1.18 U1.20
IO13_PCLK: FPC1.17 U1.21
IO14: U1.22
IO15_XCLK: FPC1.13 U1.8
IO16_Y9: FPC1.12 U1.9
IO17_Y8: FPC1.14 U1.10
IO18_Y7: FPC1.16 U1.11
IO19: OTG.A7 OTG.B7 U1.13
IO20: OTG.A6 OTG.B6 U1.14
IO21: U1.23
IO36_I2S_BLK: U1.29 U6.16
IO37_I2S_LRCLK: U1.30 U6.14
IO38: CARD1.3 H2.2 R17.1 U1.31
IO39: CARD1.5 H2.4 R18.1 U1.32
IO40: CARD1.7 H2.6 R16.1 U1.33
IO41: H2.8 U1.34
IO42: H2.10 U1.35
IO45: U1.26
IO46: U1.16
IO47: U1.24
IO48: U1.25 WS.3
IO_35_I2S_DIN: U1.28 U6.1
RTS: Q1.2 R2.2 U5.14
RXD0: R7.2 U1.36
TXD0: R6.2 TX.1 U1.37
USB_5V: C1.2 C4.2 C7.1 C8.1 OTG.A4 OTG.A9 OTG.B4 OTG.B9 TTL.A4 TTL.A9 TTL.B4 TTL.B9 U2.3 U5.16 WS.4
USB_DN: TTL.A7 TTL.B7 U5.6
USB_DP: TTL.A6 TTL.B6 U5.5
$1N1898: R8.1 TX.2
$1N1909: PWR.2 R3.2
$1N2354: R7.1 U5.2
$1N2360: R6.1 U5.3
$1N2405: C11.1 U5.4
$1N2645: Q1.1 R1.1
$1N2696: Q2.1 R2.1
$1N2996: R9.2 R10.1
$1N3750: R12.1 TTL.B5
$1N3825: R13.2 TTL.A5
$1N4216: OTG.B5 R14.1
$1N4221: OTG.A5 R15.2
$1N4989: FPC1.8 R11.1
$1N9577: LED.2 R19.2
$1N10095: FPC2.2 R20.2
$1N11048: CN1.1 U6.10
$1N11058: CN1.2 U6.9

Pads without a net: CARD1 1 2 8 9; FPC1 1 23 24; FPC2 7 8 9 10 11 15 16; OTG A8 B8; TTL A8 B8; U5 7 8 9 10 11 12 15; U6 2 4 5 6 12 13; WS 1

## Text on the board
Bottom Silkscreen Layer: SD Card
Top Silkscreen Layer: 38 | 5V | 39 | 40 | SDA | 41 | SCL | 42 | GND | 3V3 | 1 | 24 | 18 | N | P | Speaker | Author: | MYRY | Display
